# EAGLE design backplane (EAGLE 9.4.2)

## Sheet 1 of 3: Expansion Input and Buffers
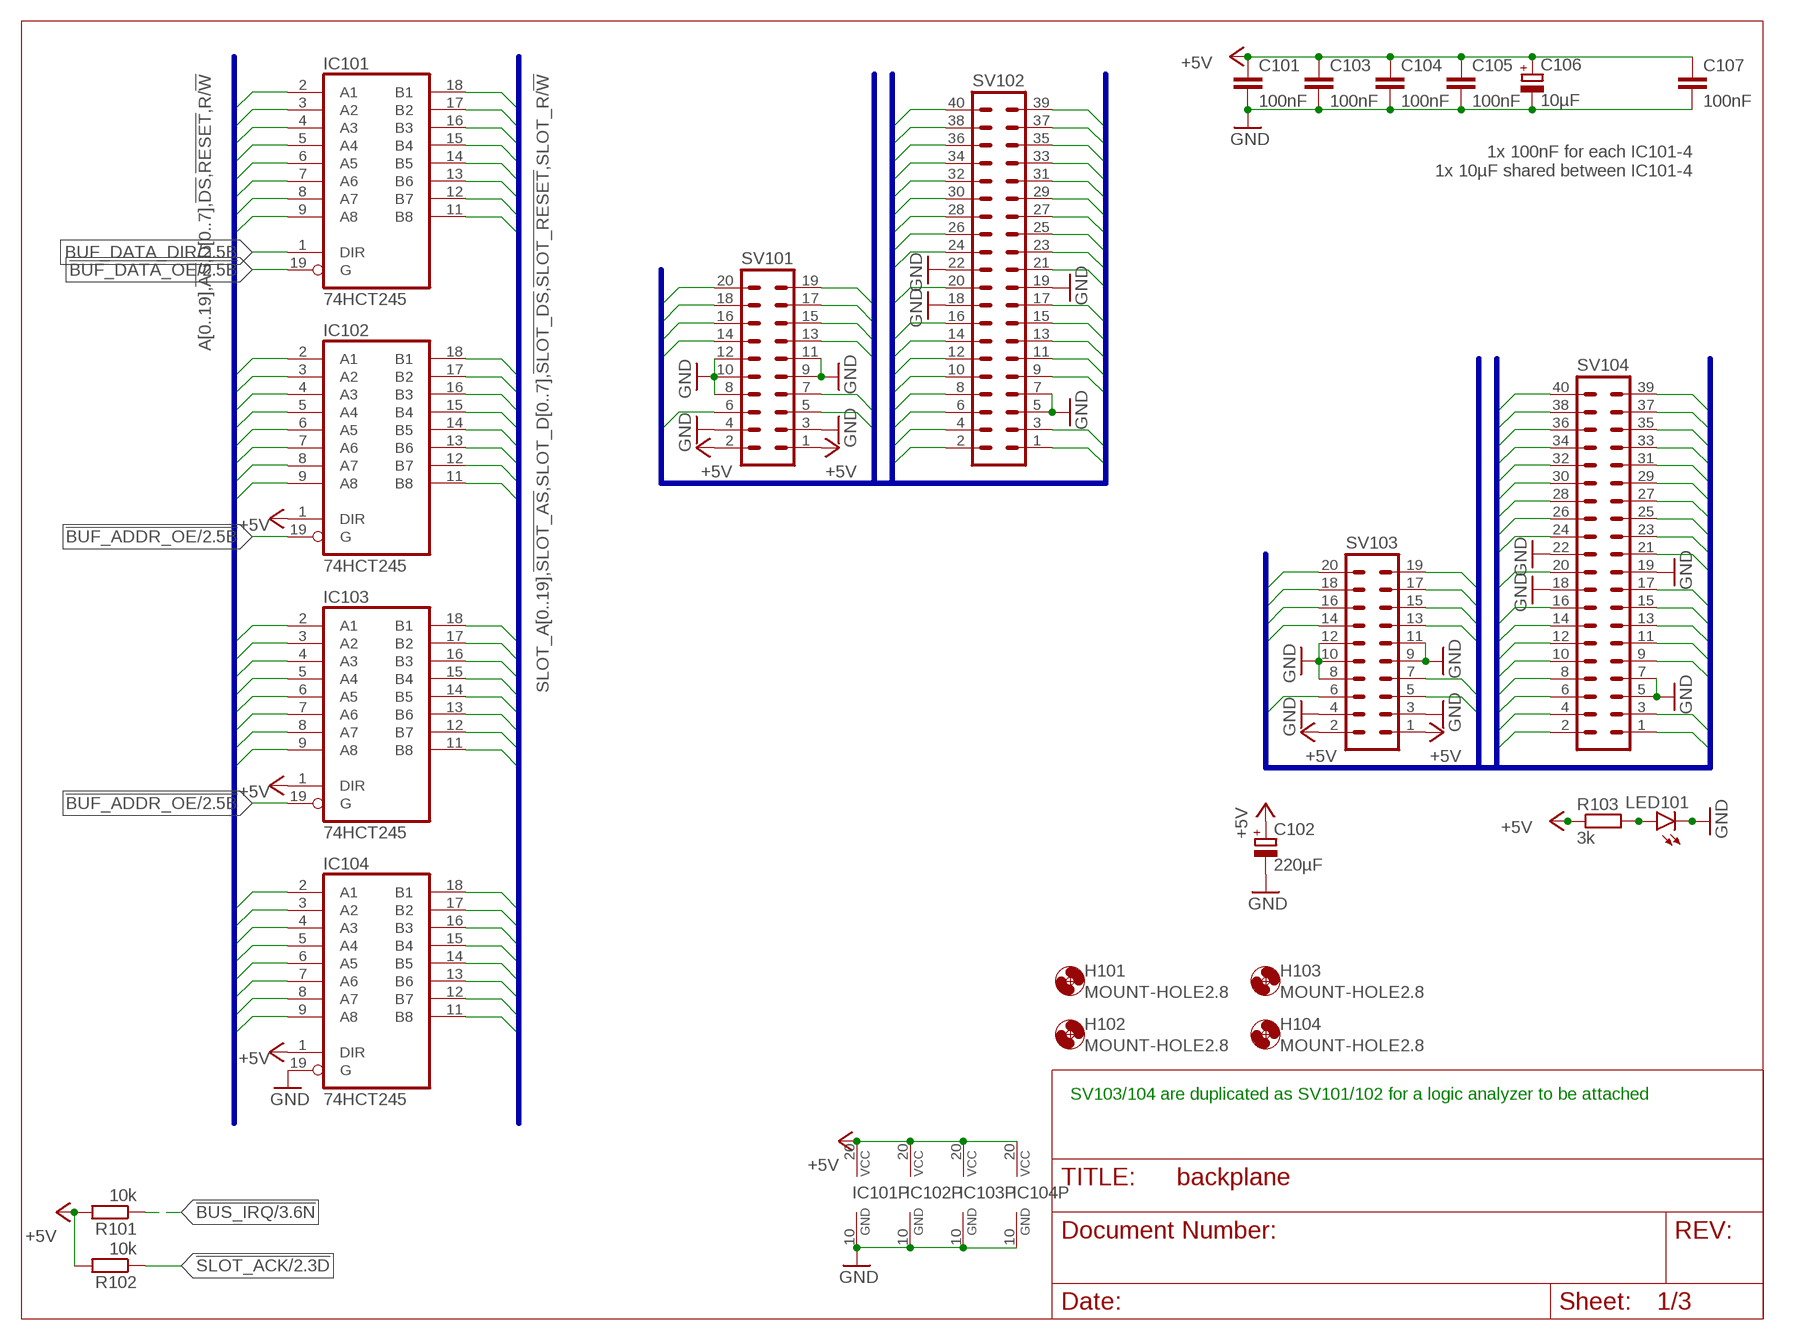
[diagram p0: schematic, sheet 1]

### Parts
C101  100nF  C-EUC0805  [C0805]
C102  220µF  CPOL-EUE3.5-8  [E3,5-8]
C103  100nF  C-EUC0805  [C0805]
C104  100nF  C-EUC0805  [C0805]
C105  100nF  C-EUC0805  [C0805]
C106  10µF  CPOL-EUSMCB  [SMC_B]
C107  100nF  C-EUC0805  [C0805]
H101  MOUNT-HOLE2.8  [2,8]
H102  MOUNT-HOLE2.8  [2,8]
H103  MOUNT-HOLE2.8  [2,8]
H104  MOUNT-HOLE2.8  [2,8]
IC101  74HCT245  74HCT245DW  [SO20W]
IC102  74HCT245  74HCT245DW  [SO20W]
IC103  74HCT245  74HCT245DW  [SO20W]
IC104  74HCT245  74HCT245DW  [SO20W]
LED101  LEDCHIPLED_1206  [CHIPLED_1206]
R101  10k  R-EU_R2012  [R2012]
R102  10k  R-EU_R2012  [R2012]
R103  3k  R-EU_R2012  [R2012]
SV101  MA10-2  [MA10-2]
SV102  MA20-2  [MA20-2]
SV103  MA10-2W  [MA10-2W]
SV104  MA20-2W  [MA20-2W]

### Nets
!AS: IC104.2(A1) SV102.33 SV104.33
!BERR: SV102.9 SV104.9
!BG: SV102.25 SV104.25
!BR: SV102.23 SV104.23
!BUF_ADDR_OE: IC102.19(G) IC103.19(G) ; also sheet 2
!BUF_DATA_OE: IC101.19(G) ; also sheet 2
!BUS_CS: SV101.7 SV103.7 ; also sheet 2
!BUS_DTACK: SV101.6 SV103.6 ; also sheet 2
!BUS_IRQ: R101.1 SV101.5 SV103.5 ; also sheet 3
!DS: IC104.3(A2) SV102.31 SV104.31
!DTACK: SV102.27 SV104.27
!HALT: SV102.17 SV104.17
!RESET: IC104.9(A8) SV102.15 SV104.15
!SLOT_ACK: R102.1 ; also sheet 2,3
!SLOT_AS: IC104.18(B1) ; also sheet 3
!SLOT_DS: IC104.17(B2) ; also sheet 2,3
!SLOT_RESET: IC104.11(B8) ; also sheet 2,3
!VPA: SV102.11 SV104.11
+5V: C101.1 C102.+ C103.1 C104.1 C105.1 C106.+ C107.1 IC101.20(VCC) IC102.1(DIR) IC102.20(VCC) IC103.1(DIR) IC103.20(VCC) IC104.1(DIR) IC104.20(VCC) R101.2 R102.2 R103.1 SV101.1 SV101.2 SV103.1 SV103.2 ; also sheet 2,3
A0: IC102.5(A4) SV101.17 SV103.17
A1: IC102.7(A6) SV101.15 SV103.15
A2: IC102.9(A8) SV101.13 SV103.13
A3: IC102.8(A7) SV101.14 SV103.14
A4: IC102.6(A5) SV101.16 SV103.16
A5: IC102.4(A3) SV101.18 SV103.18
A6: IC102.3(A2) SV101.20 SV103.20
A7: IC102.2(A1) SV102.2 SV104.2
A8: IC103.9(A8) SV102.4 SV104.4
A9: IC103.8(A7) SV102.6 SV104.6
A10: IC103.7(A6) SV102.8 SV104.8
A11: IC103.6(A5) SV102.10 SV104.10
A12: IC103.5(A4) SV102.12 SV104.12
A13: IC103.4(A3) SV102.14 SV104.14
A14: IC103.3(A2) SV102.16 SV104.16
A15: IC103.2(A1) SV102.20 SV104.20
A16: IC104.8(A7) SV102.24 SV104.24
A17: IC104.7(A6) SV102.26 SV104.26
A18: IC104.6(A5) SV102.28 SV104.28
A19: IC104.4(A3) SV102.30 SV104.30
BUF_DATA_DIR: IC101.1(DIR) ; also sheet 2
CLK: SV102.21 SV104.21 ; also sheet 2
D0: IC101.7(A6) SV102.35 SV104.35
D1: IC101.5(A4) SV102.37 SV104.37
D2: IC101.3(A2) SV102.39 SV104.39
D3: IC101.2(A1) SV102.40 SV104.40
D4: IC101.4(A3) SV102.38 SV104.38
D5: IC101.6(A5) SV102.36 SV104.36
D6: IC101.8(A7) SV102.34 SV104.34
D7: IC101.9(A8) SV102.32 SV104.32
E: SV102.13 SV104.13
FC0: SV101.19 SV103.19
FC1: SV102.1 SV104.1
FC2: SV102.3 SV104.3
GND: C101.2 C102.- C103.2 C104.2 C105.2 C106.- C107.2 IC101.10(GND) IC102.10(GND) IC103.10(GND) IC104.10(GND) IC104.19(G) LED101.C SV101.3 SV101.4 SV101.8 SV101.9 SV101.10 SV101.11 SV101.12 SV102.5 SV102.7 SV102.18 SV102.19 SV102.22 SV103.3 SV103.4 SV103.8 SV103.9 SV103.10 SV103.11 SV103.12 SV104.5 SV104.7 SV104.18 SV104.19 SV104.22 ; also sheet 2,3
N$4: LED101.A R103.2
R/!W!: IC104.5(A4) SV102.29 SV104.29
SLOT_A0: IC102.15(B4) ; also sheet 3
SLOT_A1: IC102.13(B6) ; also sheet 3
SLOT_A2: IC102.11(B8) ; also sheet 3
SLOT_A3: IC102.12(B7) ; also sheet 3
SLOT_A4: IC102.14(B5) ; also sheet 3
SLOT_A5: IC102.16(B3) ; also sheet 3
SLOT_A6: IC102.17(B2) ; also sheet 3
SLOT_A7: IC102.18(B1) ; also sheet 3
SLOT_A8: IC103.11(B8) ; also sheet 3
SLOT_A9: IC103.12(B7) ; also sheet 3
SLOT_A10: IC103.13(B6) ; also sheet 3
SLOT_A11: IC103.14(B5) ; also sheet 3
SLOT_A12: IC103.15(B4) ; also sheet 3
SLOT_A13: IC103.16(B3) ; also sheet 3
SLOT_A14: IC103.17(B2) ; also sheet 3
SLOT_A15: IC103.18(B1) ; also sheet 3
SLOT_A16: IC104.12(B7) ; also sheet 2
SLOT_A17: IC104.13(B6) ; also sheet 2
SLOT_A18: IC104.14(B5) ; also sheet 2
SLOT_A19: IC104.16(B3) ; also sheet 2
SLOT_D0: IC101.13(B6) ; also sheet 3
SLOT_D1: IC101.15(B4) ; also sheet 3
SLOT_D2: IC101.17(B2) ; also sheet 3
SLOT_D3: IC101.18(B1) ; also sheet 3
SLOT_D4: IC101.16(B3) ; also sheet 3
SLOT_D5: IC101.14(B5) ; also sheet 3
SLOT_D6: IC101.12(B7) ; also sheet 3
SLOT_D7: IC101.11(B8) ; also sheet 3
SLOT_R/!W!: IC104.15(B4) ; also sheet 2,3

### Buses
A[0..19],!AS,!BERR,!BG,!BR,!BUS_CS,!BUS_DTACK,!BUS_IRQ,CLK,D[0..7],!DS,!DTACK,E,FC[0..2],!HALT,!RESET,R/!W!,!VPA
A[0..19],!AS,D[0..7],!DS,!RESET,R/!W!
SLOT_A[0..19],!SLOT_AS,SLOT_D[0..7],!SLOT_DS,!SLOT_RESET,SLOT_R/!W!

### Notes on the sheet
- 1x 100nF for each IC101-4
  1x 10µF shared between IC101-4
- SV103/104 are duplicated as SV101/102 for a logic analyzer to be attached

## Sheet 2 of 3: Logic
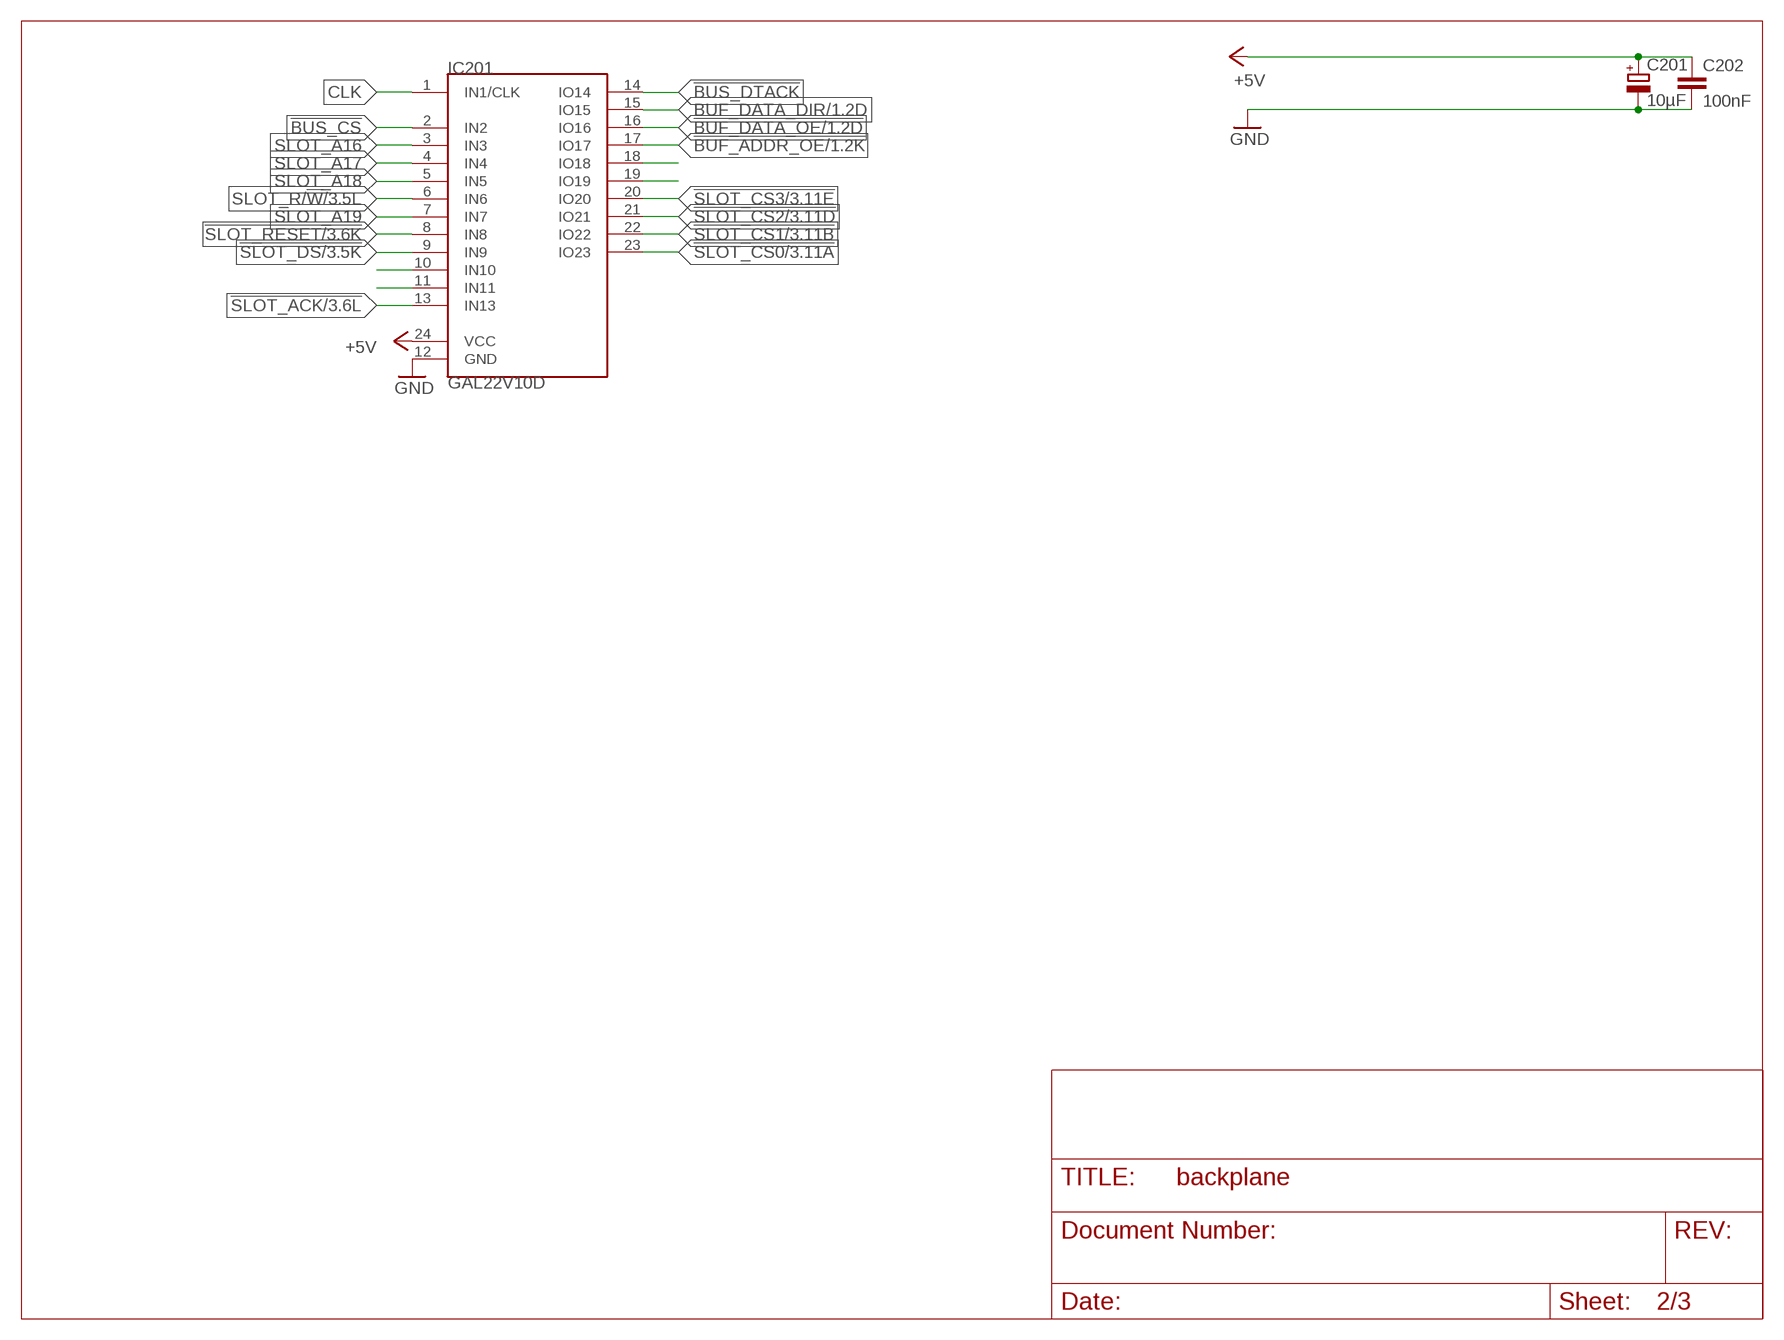
[diagram p1: schematic, sheet 2]

### Parts
C201  10µF  CPOL-EUSMCB  [SMC_B]
C202  100nF  C-EUC0805  [C0805]
IC201  GAL22V10D  GAL22V10DIP24  [DIL24S]

### Nets
!BUF_ADDR_OE: IC201.17(IO17) ; also sheet 1
!BUF_DATA_OE: IC201.16(IO16) ; also sheet 1
!BUS_CS: IC201.2(IN2) ; also sheet 1
!BUS_DTACK: IC201.14(IO14) ; also sheet 1
!SLOT_ACK: IC201.13(IN13) ; also sheet 1,3
!SLOT_CS0: IC201.23(IO23) ; also sheet 3
!SLOT_CS1: IC201.22(IO22) ; also sheet 3
!SLOT_CS2: IC201.21(IO21) ; also sheet 3
!SLOT_CS3: IC201.20(IO20) ; also sheet 3
!SLOT_DS: IC201.9(IN9) ; also sheet 1,3
!SLOT_RESET: IC201.8(IN8) ; also sheet 1,3
+5V: C201.+ C202.1 IC201.24(VCC) ; also sheet 1,3
BUF_DATA_DIR: IC201.15(IO15) ; also sheet 1
CLK: IC201.1(IN1/CLK) ; also sheet 1
GND: C201.- C202.2 IC201.12(GND) ; also sheet 1,3
N$14: IC201.10(IN10)
N$15: IC201.11(IN11)
N$20: IC201.19(IO19)
N$27: IC201.18(IO18)
SLOT_A16: IC201.3(IN3) ; also sheet 1
SLOT_A17: IC201.4(IN4) ; also sheet 1
SLOT_A18: IC201.5(IN5) ; also sheet 1
SLOT_A19: IC201.7(IN7) ; also sheet 1
SLOT_R/!W!: IC201.6(IN6) ; also sheet 1,3

## Sheet 3 of 3: Expansion Slots
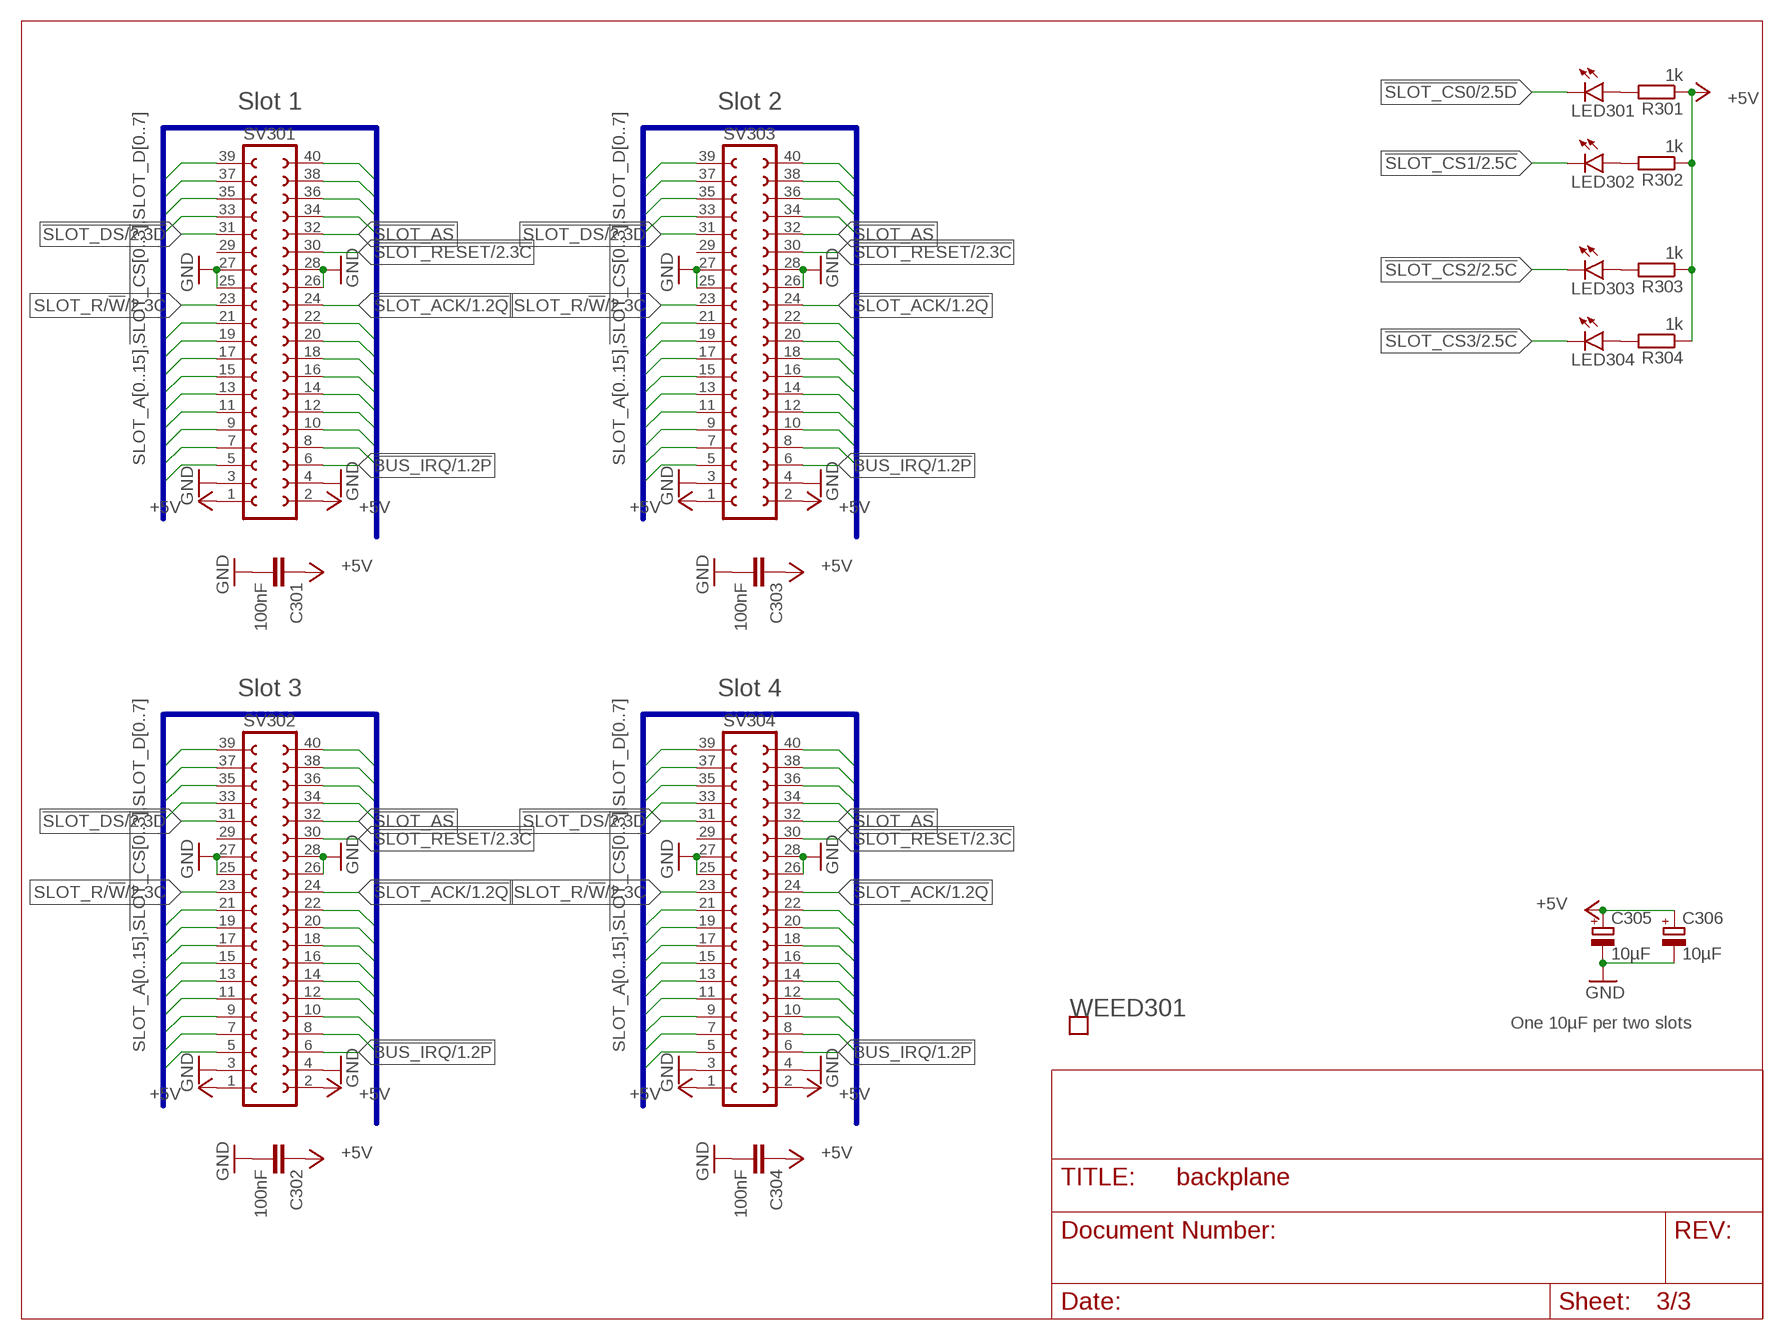
[diagram p2: schematic, sheet 3]

### Parts
C301  100nF  C-EUC0805  [C0805]
C302  100nF  C-EUC0805  [C0805]
C303  100nF  C-EUC0805  [C0805]
C304  100nF  C-EUC0805  [C0805]
C305  10µF  CPOL-EUSMCB  [SMC_B]
C306  10µF  CPOL-EUSMCB  [SMC_B]
LED301  LEDCHIPLED_1206  [CHIPLED_1206]
LED302  LEDCHIPLED_1206  [CHIPLED_1206]
LED303  LEDCHIPLED_1206  [CHIPLED_1206]
LED304  LEDCHIPLED_1206  [CHIPLED_1206]
R301  1k  R-EU_R2012  [R2012]
R302  1k  R-EU_R2012  [R2012]
R303  1k  R-EU_R2012  [R2012]
R304  1k  R-EU_R2012  [R2012]
SV301  FE20-2  [FE20-2]
SV302  FE20-2  [FE20-2]
SV303  FE20-2  [FE20-2]
SV304  FE20-2  [FE20-2]
WEED301  WEED  [DOINK]

### Nets
!BUS_IRQ: SV301.6 SV302.6 SV303.6 SV304.6 ; also sheet 1
!SLOT_ACK: SV301.24 SV302.24 SV303.24 SV304.24 ; also sheet 1,2
!SLOT_AS: SV301.32 SV302.32 SV303.32 SV304.32 ; also sheet 1
!SLOT_CS0: LED301.C SV301.5 ; also sheet 2
!SLOT_CS1: LED302.C SV303.5 ; also sheet 2
!SLOT_CS2: LED303.C SV302.5 ; also sheet 2
!SLOT_CS3: LED304.C SV304.5 ; also sheet 2
!SLOT_DS: SV301.31 SV302.31 SV303.31 SV304.31 ; also sheet 1,2
!SLOT_RESET: SV301.30 SV302.30 SV303.30 SV304.30 ; also sheet 1,2
+5V: C301.1 C302.1 C303.1 C304.1 C305.+ C306.+ R301.1 R302.1 R303.1 R304.1 SV301.1 SV301.2 SV302.1 SV302.2 SV303.1 SV303.2 SV304.1 SV304.2 ; also sheet 1,2
GND: C301.2 C302.2 C303.2 C304.2 C305.- C306.- SV301.3 SV301.4 SV301.25 SV301.26 SV301.27 SV301.28 SV302.3 SV302.4 SV302.25 SV302.26 SV302.27 SV302.28 SV303.3 SV303.4 SV303.25 SV303.26 SV303.27 SV303.28 SV304.3 SV304.4 SV304.25 SV304.26 SV304.27 SV304.28 ; also sheet 1,2
N$1: LED302.A R302.2
N$2: LED301.A R301.2
N$3: LED304.A R304.2
N$5: LED303.A R303.2
SLOT_A0: SV301.12 SV302.12 SV303.12 SV304.12 ; also sheet 1
SLOT_A1: SV301.10 SV302.10 SV303.10 SV304.10 ; also sheet 1
SLOT_A2: SV301.8 SV302.8 SV303.8 SV304.8 ; also sheet 1
SLOT_A3: SV301.7 SV302.7 SV303.7 SV304.7 ; also sheet 1
SLOT_A4: SV301.9 SV302.9 SV303.9 SV304.9 ; also sheet 1
SLOT_A5: SV301.11 SV302.11 SV303.11 SV304.11 ; also sheet 1
SLOT_A6: SV301.14 SV302.14 SV303.14 SV304.14 ; also sheet 1
SLOT_A7: SV301.13 SV302.13 SV303.13 SV304.13 ; also sheet 1
SLOT_A8: SV301.16 SV302.16 SV303.16 SV304.16 ; also sheet 1
SLOT_A9: SV301.15 SV302.15 SV303.15 SV304.15 ; also sheet 1
SLOT_A10: SV301.18 SV302.18 SV303.18 SV304.18 ; also sheet 1
SLOT_A11: SV301.17 SV302.17 SV303.17 SV304.17 ; also sheet 1
SLOT_A12: SV301.20 SV302.20 SV303.20 SV304.20 ; also sheet 1
SLOT_A13: SV301.19 SV302.19 SV303.19 SV304.19 ; also sheet 1
SLOT_A14: SV301.22 SV302.22 SV303.22 SV304.22 ; also sheet 1
SLOT_A15: SV301.21 SV302.21 SV303.21 SV304.21 ; also sheet 1
SLOT_D0: SV301.35 SV302.35 SV303.35 SV304.35 ; also sheet 1
SLOT_D1: SV301.37 SV302.37 SV303.37 SV304.37 ; also sheet 1
SLOT_D2: SV301.39 SV302.39 SV303.39 SV304.39 ; also sheet 1
SLOT_D3: SV301.40 SV302.40 SV303.40 SV304.40 ; also sheet 1
SLOT_D4: SV301.38 SV302.38 SV303.38 SV304.38 ; also sheet 1
SLOT_D5: SV301.36 SV302.36 SV303.36 SV304.36 ; also sheet 1
SLOT_D6: SV301.34 SV302.34 SV303.34 SV304.34 ; also sheet 1
SLOT_D7: SV301.33 SV302.33 SV303.33 SV304.33 ; also sheet 1
SLOT_R/!W!: SV301.23 SV302.23 SV303.23 SV304.23 ; also sheet 1,2
Unconnected: SV301.29 SV302.29 SV303.29 SV304.29

### Buses
SLOT_A[0..15],!SLOT_CS[0..3],SLOT_D[0..7]

### Notes on the sheet
- Slot 1 | Slot 2
- Slot 3 | Slot 4
- One 10µF per two slots

## Library data of the parts
C101 C103-C105 C107 C202 C301-C304 = rcl:C-EU: CAPACITOR, European symbol; MOUSER: 710-885012207072; SPICEPREFIX: C
C102 = rcl:CPOL-EU: POLARIZED CAPACITOR, European symbol; MOUSER: 710-860020474012; SPICEPREFIX: C
C106 C201 C305 C306 = rcl:CPOL-EU: POLARIZED CAPACITOR, European symbol; MOUSER: 581-TAJB106K020RNJV; SPICEPREFIX: C
H101-H104 = holes:MOUNT-HOLE: MOUNTING HOLE with drill center marker
IC101-IC104 = 74xx-eu:74*245: Octal BUS TRANSCEIVER, 3-state; MOUSER: 595-SN74HCT245DBR
IC201 = 68komputer:GAL22V10: GAL22V10D – Generic Array Logic Datasheet <http://web.mit.edu/6.115/www/document/gal22v10.pdf>; MOUSER_SOCKET: 575-11044324
LED101 = led:LED: LED OSRAM: - CHIPLED LG R971, LG N971, LY N971, LG Q971, LY Q971, LO R971, LY R971 LH N974, LH R974 LS Q976, LO Q976, LY Q976 LO Q996 - Hyper CHIPLED LW Q18S LB Q993, LB Q99A, LB R99A - SideLED LS A670, LO A670, LY A670, LG A670, LP A670 LB A673, LV A673, LT A673, LW A673 LH A674 LY A675 LS A676, LA A676, LO A676, LY A676, LW A676 LS A679, LY A679, LG A679 - Hyper Micro SIDELED® LS Y876, LA Y876, LO Y876, LY Y876 LT Y87S - SmartLED LW L88C, LW L88S LB L89C, LB L89S, LG L890 LS L89K, LO L89K, LY L89K LS L896, LA L896, LO L896, LY L896 - TOPLED LS T670, LO T670, LY T670, LG T670, LP T670 LSG T670, LSP T670, LSY T670, LOP T670, LYG T670 LG T671, LOG T671, LSG T671 LB T673, LV T673, LT T673, LW T673 LH T674 LS T676, LA T676, LO T676, LY T676, LB T676, LH T676, LSB T676, LW T676 LB T67C, LV T67C, LT T67C, LS T67K, LO T67K, LY T67K, LW E67C LS E67B, LA E67B, LO E67B, LY E67B, LB E67C, LV E67C, LT E67C LW T67C LS T679, LY T679, LG T679 LS T770, LO T770, LY T770, LG T770, LP T770 LB T773, LV T773, LT T773, LW T773 LH T774 LS E675, LA E675, LY E675, LS T675 LS T776, LA T776, LO T776, LY T776, LB T776 LHGB T686 LT T68C, LB T68C - Hyper Mini TOPLED® LB M676 - Mini TOPLED Santana® LG M470 LS M47K, LO M47K, LY M47K Source: http://www.osram.convergy.de LUXEON: - LUMILED® LXK2-PW12-R00, LXK2-PW12-S00, LXK2-PW14-U00, LXK2-PW14-V00 LXK2-PM12-R00, LXK2-PM12-S00, LXK2-PM14-U00 LXK2-PE12-Q00, LXK2-PE12-R00, LXK2-PE12-S00, LXK2-PE14-T00, LXK2-PE14-U00 LXK2-PB12-K00, LXK2-PB12-L00, LXK2-PB12-M00, LXK2-PB14-N00, LXK2-PB14-P00, LXK2-PB14-Q00 LXK2-PR12-L00, LXK2-PR12-M00, LXK2-PR14-Q00, LXK2-PR14-R00 LXK2-PD12-Q00, LXK2-PD12-R00, LXK2-PD12-S00 LXK2-PH12-R00, LXK2-PH12-S00 LXK2-PL12-P00, LXK2-PL12-Q00, LXK2-PL12-R00 Source: www.luxeon.com KINGBRIGHT: KA-3528ASYC Source: www.kingbright.com; MOUSER: 710-156120YS75300
LED301-LED304 = led:LED: LED OSRAM: - CHIPLED LG R971, LG N971, LY N971, LG Q971, LY Q971, LO R971, LY R971 LH N974, LH R974 LS Q976, LO Q976, LY Q976 LO Q996 - Hyper CHIPLED LW Q18S LB Q993, LB Q99A, LB R99A - SideLED LS A670, LO A670, LY A670, LG A670, LP A670 LB A673, LV A673, LT A673, LW A673 LH A674 LY A675 LS A676, LA A676, LO A676, LY A676, LW A676 LS A679, LY A679, LG A679 - Hyper Micro SIDELED® LS Y876, LA Y876, LO Y876, LY Y876 LT Y87S - SmartLED LW L88C, LW L88S LB L89C, LB L89S, LG L890 LS L89K, LO L89K, LY L89K LS L896, LA L896, LO L896, LY L896 - TOPLED LS T670, LO T670, LY T670, LG T670, LP T670 LSG T670, LSP T670, LSY T670, LOP T670, LYG T670 LG T671, LOG T671, LSG T671 LB T673, LV T673, LT T673, LW T673 LH T674 LS T676, LA T676, LO T676, LY T676, LB T676, LH T676, LSB T676, LW T676 LB T67C, LV T67C, LT T67C, LS T67K, LO T67K, LY T67K, LW E67C LS E67B, LA E67B, LO E67B, LY E67B, LB E67C, LV E67C, LT E67C LW T67C LS T679, LY T679, LG T679 LS T770, LO T770, LY T770, LG T770, LP T770 LB T773, LV T773, LT T773, LW T773 LH T774 LS E675, LA E675, LY E675, LS T675 LS T776, LA T776, LO T776, LY T776, LB T776 LHGB T686 LT T68C, LB T68C - Hyper Mini TOPLED® LB M676 - Mini TOPLED Santana® LG M470 LS M47K, LO M47K, LY M47K Source: http://www.osram.convergy.de LUXEON: - LUMILED® LXK2-PW12-R00, LXK2-PW12-S00, LXK2-PW14-U00, LXK2-PW14-V00 LXK2-PM12-R00, LXK2-PM12-S00, LXK2-PM14-U00 LXK2-PE12-Q00, LXK2-PE12-R00, LXK2-PE12-S00, LXK2-PE14-T00, LXK2-PE14-U00 LXK2-PB12-K00, LXK2-PB12-L00, LXK2-PB12-M00, LXK2-PB14-N00, LXK2-PB14-P00, LXK2-PB14-Q00 LXK2-PR12-L00, LXK2-PR12-M00, LXK2-PR14-Q00, LXK2-PR14-R00 LXK2-PD12-Q00, LXK2-PD12-R00, LXK2-PD12-S00 LXK2-PH12-R00, LXK2-PH12-S00 LXK2-PL12-P00, LXK2-PL12-Q00, LXK2-PL12-R00 Source: www.luxeon.com KINGBRIGHT: KA-3528ASYC Source: www.kingbright.com; MOUSER: 710-156120VS75300
R101 R102 = rcl:R-EU_: RESISTOR, European symbol; MOUSER: 652-CR0805FX-1002ELF; SPICEPREFIX: R
R103 = rcl:R-EU_: RESISTOR, European symbol; MOUSER: 652-CR0805JW-302ELF; SPICEPREFIX: R
R301-R304 = rcl:R-EU_: RESISTOR, European symbol; MOUSER: 652-CR0805FX-1001ELF; SPICEPREFIX: R
SV101 = con-lstb:MA10-2: PIN HEADER; OC_FARNELL: unknown; OC_NEWARK: unknown
SV102 = con-lstb:MA20-2: PIN HEADER; OC_FARNELL: unknown; OC_NEWARK: unknown
SV103 = con-lstb:MA10-2W: PIN HEADER; OC_FARNELL: unknown; OC_NEWARK: unknown
SV104 = con-lstb:MA20-2W: PIN HEADER; OC_FARNELL: unknown; OC_NEWARK: unknown
SV301-SV304 = con-lsta:FE20-2: FEMALE HEADER; MOUSER: 710-61304021821; OC_FARNELL: unknown; OC_NEWARK: unknown
WEED301 = 68komputer:WEED

## Net classes
0 default: width 0.203 mm

## Board
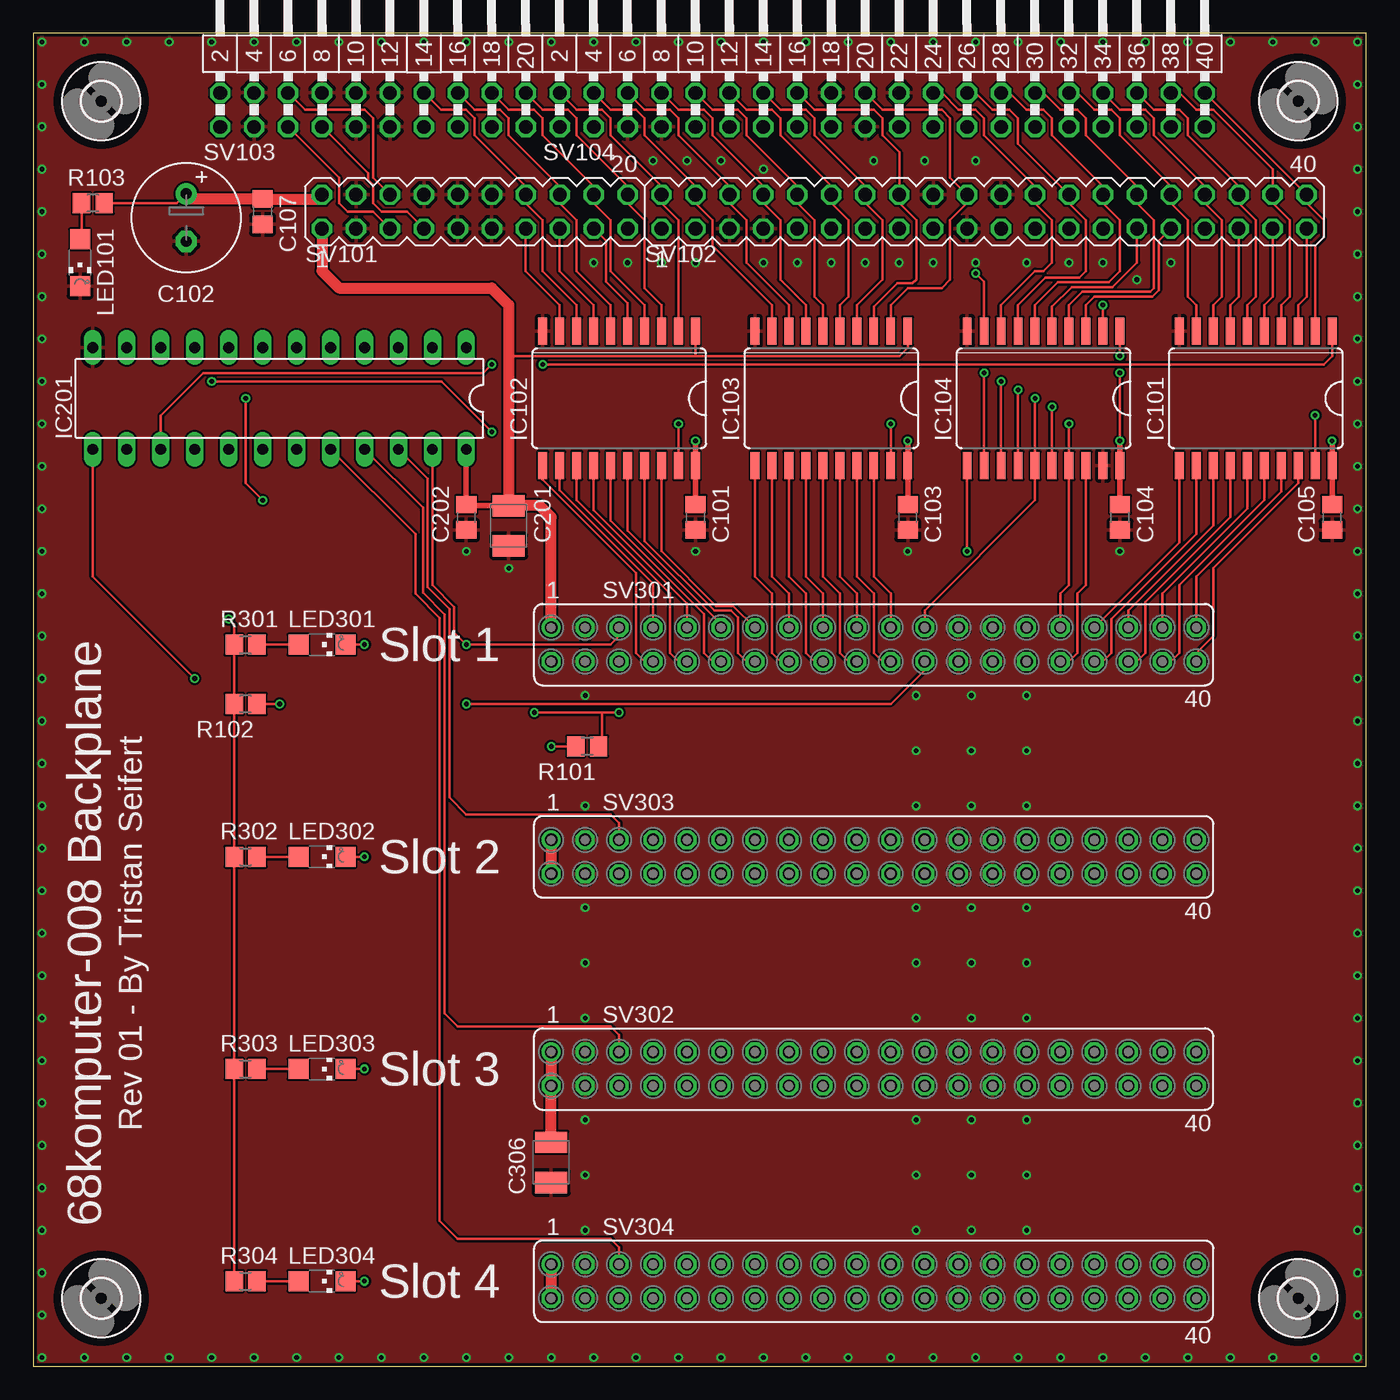
[diagram p3: board, top side]
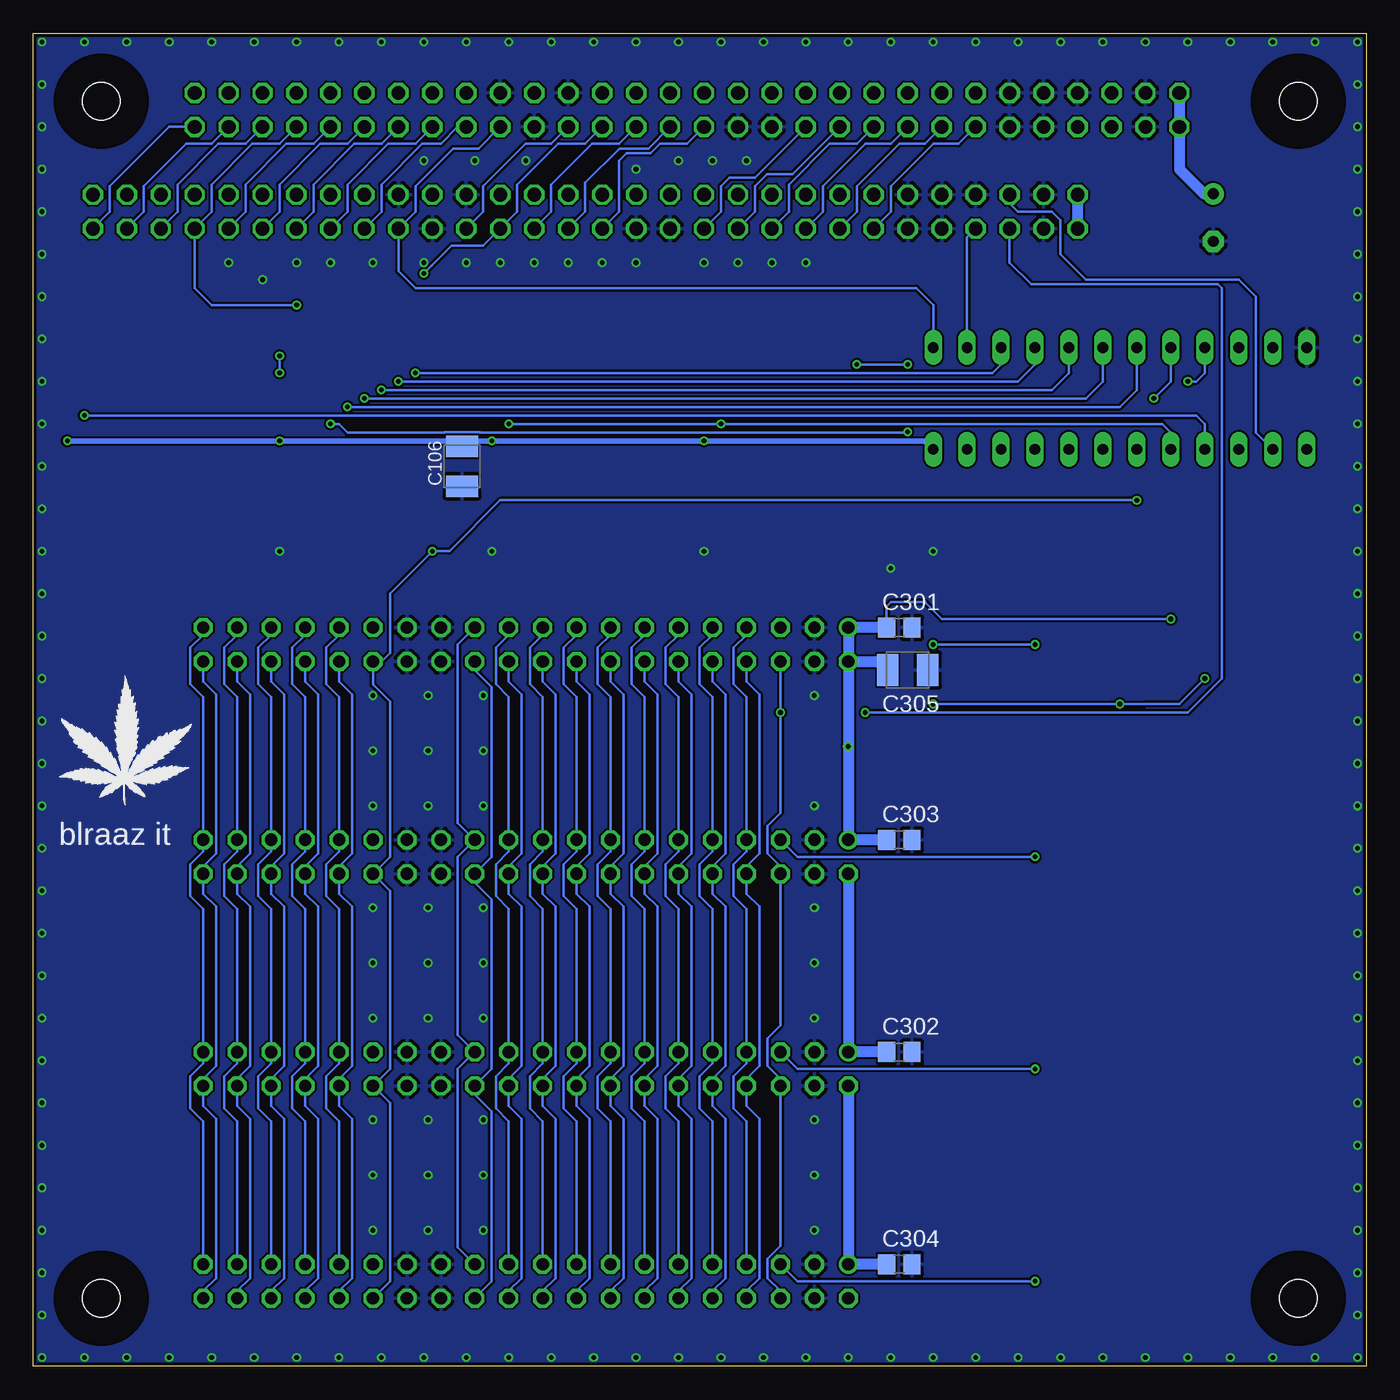
[diagram p4: board, bottom side, seen from below]

Size 99.69 x 99.69 mm. Coordinates in mm from the lower left corner, seen from the top.
Outline: 0,0 99.69,0 99.69,99.69 0,99.69 0,0
Copper layers (1*16): Top 0.035mm / dielectric 1.5mm / Bottom 0.035mm
Design rules "dirt_cheap_dirty_boards.v1.1": minimum track width 6mil, minimum drill 12mil, track to track 6mil, track to pad 6mil, pad to pad 6mil, via to via 6mil, smd to smd 0mil, copper to edge 10mil, drill to drill 10mil, minimum pad ring 10mil, minimum via ring 6mil, stop-mask expansion 2mil, vias tented up to drill 25mil, thermal gap 10mil

### Footprints (pad centres in the part's own frame; a part is rotated, then mirrored left to right if it is on the bottom)
C0805 = smd 1.3 x 1.5: 1 -0.95,0; 2 0.95,0
E3,5-8 = drill 0.813 pad 1.6: + -1.778,0 | drill 0.813 pad 1.6 octagon: - 1.778,0
SMC_B = smd 1.6 x 2.4: + -1.5,0; - 1.5,0
2,8 = hole 2.8: 0,0
SO20W = smd 0.66 x 2.032: 1 -5.715,-5.029; 2 -4.445,-5.029; 3 -3.175,-5.029; 4 -1.905,-5.029; 5 -0.635,-5.029; 6 0.635,-5.029; 7 1.905,-5.029; 8 3.175,-5.029; 9 4.445,-5.029; 10 5.715,-5.029; 11 5.715,5.029; 12 4.445,5.029; 13 3.175,5.029; 14 1.905,5.029; 15 0.635,5.029; 16 -0.635,5.029; 17 -1.905,5.029; 18 -3.175,5.029; 19 -4.445,5.029; 20 -5.715,5.029
DIL24S = drill 0.813 long: 1 -13.97,-3.81; 2 -11.43,-3.81; 3 -8.89,-3.81; 4 -6.35,-3.81; 5 -3.81,-3.81; 6 -1.27,-3.81; 7 1.27,-3.81; 8 3.81,-3.81; 9 6.35,-3.81; 10 8.89,-3.81; 11 11.43,-3.81; 12 13.97,-3.81; 13 13.97,3.81; 14 11.43,3.81; 15 8.89,3.81; 16 6.35,3.81; 17 3.81,3.81; 18 1.27,3.81; 19 -1.27,3.81; 20 -3.81,3.81; 21 -6.35,3.81; 22 -8.89,3.81; 23 -11.43,3.81; 24 -13.97,3.81
CHIPLED_1206 = smd 1.5 x 1.5: A 0,-1.75; C 0,1.75
R2012 = smd 1.3 x 1.5: 1 -0.85,0; 2 0.85,0
MA10-2 = drill 1.016 octagon: 1 -11.43,-1.27; 2 -11.43,1.27; 3 -8.89,-1.27; 4 -8.89,1.27; 5 -6.35,-1.27; 6 -6.35,1.27; 7 -3.81,-1.27; 8 -3.81,1.27; 9 -1.27,-1.27; 10 -1.27,1.27; 11 1.27,-1.27; 12 1.27,1.27; 13 3.81,-1.27; 14 3.81,1.27; 15 6.35,-1.27; 16 6.35,1.27; 17 8.89,-1.27; 18 8.89,1.27; 19 11.43,-1.27; 20 11.43,1.27
MA20-2 = drill 1.016 octagon: 1 -24.13,-1.27; 2 -24.13,1.27; 3 -21.59,-1.27; 4 -21.59,1.27; 5 -19.05,-1.27; 6 -19.05,1.27; 7 -16.51,-1.27; 8 -16.51,1.27; 9 -13.97,-1.27; 10 -13.97,1.27; 11 -11.43,-1.27; 12 -11.43,1.27; 13 -8.89,-1.27; 14 -8.89,1.27; 15 -6.35,-1.27; 16 -6.35,1.27; 17 -3.81,-1.27; 18 -3.81,1.27; 19 -1.27,-1.27; 20 -1.27,1.27; 21 1.27,-1.27; 22 1.27,1.27; 23 3.81,-1.27; 24 3.81,1.27; 25 6.35,-1.27; 26 6.35,1.27; 27 8.89,-1.27; 28 8.89,1.27; 29 11.43,-1.27; 30 11.43,1.27; 31 13.97,-1.27; 32 13.97,1.27; 33 16.51,-1.27; 34 16.51,1.27; 35 19.05,-1.27; 36 19.05,1.27; 37 21.59,-1.27; 38 21.59,1.27; 39 24.13,-1.27; 40 24.13,1.27
MA10-2W = drill 1.016 octagon: 1 -11.43,-1.27; 2 -11.43,1.27; 3 -8.89,-1.27; 4 -8.89,1.27; 5 -6.35,-1.27; 6 -6.35,1.27; 7 -3.81,-1.27; 8 -3.81,1.27; 9 -1.27,-1.27; 10 -1.27,1.27; 11 1.27,-1.27; 12 1.27,1.27; 13 3.81,-1.27; 14 3.81,1.27; 15 6.35,-1.27; 16 6.35,1.27; 17 8.89,-1.27; 18 8.89,1.27; 19 11.43,-1.27; 20 11.43,1.27
MA20-2W = drill 1.016 octagon: 1 -24.13,-1.27; 2 -24.13,1.27; 3 -21.59,-1.27; 4 -21.59,1.27; 5 -19.05,-1.27; 6 -19.05,1.27; 7 -16.51,-1.27; 8 -16.51,1.27; 9 -13.97,-1.27; 10 -13.97,1.27; 11 -11.43,-1.27; 12 -11.43,1.27; 13 -8.89,-1.27; 14 -8.89,1.27; 15 -6.35,-1.27; 16 -6.35,1.27; 17 -3.81,-1.27; 18 -3.81,1.27; 19 -1.27,-1.27; 20 -1.27,1.27; 21 1.27,-1.27; 22 1.27,1.27; 23 3.81,-1.27; 24 3.81,1.27; 25 6.35,-1.27; 26 6.35,1.27; 27 8.89,-1.27; 28 8.89,1.27; 29 11.43,-1.27; 30 11.43,1.27; 31 13.97,-1.27; 32 13.97,1.27; 33 16.51,-1.27; 34 16.51,1.27; 35 19.05,-1.27; 36 19.05,1.27; 37 21.59,-1.27; 38 21.59,1.27; 39 24.13,-1.27; 40 24.13,1.27
FE20-2 = drill 0.914: 1 -24.13,1.27 | drill 0.914 octagon: 2 -24.13,-1.27; 3 -21.59,1.27; 4 -21.59,-1.27; 5 -19.05,1.27; 6 -19.05,-1.27; 7 -16.51,1.27; 8 -16.51,-1.27; 9 -13.97,1.27; 10 -13.97,-1.27; 11 -11.43,1.27; 12 -11.43,-1.27; 13 -8.89,1.27; 14 -8.89,-1.27; 15 -6.35,1.27; 16 -6.35,-1.27; 17 -3.81,1.27; 18 -3.81,-1.27; 19 -1.27,1.27; 20 -1.27,-1.27; 21 1.27,1.27; 22 1.27,-1.27; 23 3.81,1.27; 24 3.81,-1.27; 25 6.35,1.27; 26 6.35,-1.27; 27 8.89,1.27; 28 8.89,-1.27; 29 11.43,1.27; 30 11.43,-1.27; 31 13.97,1.27; 32 13.97,-1.27; 33 16.51,1.27; 34 16.51,-1.27; 35 19.05,1.27; 36 19.05,-1.27; 37 21.59,1.27; 38 21.59,-1.27; 39 24.13,1.27; 40 24.13,-1.27

### Placement (x,y rotation side)
C101  49.53,63.5 270 top
C102  11.43,85.92 270 top
C103  65.41,63.5 270 top
C104  81.28,63.5 270 top
C105  97.16,63.5 270 top
C106  67.63,67.31 270 bottom
C107  17.14,86.36 270 top
C201  35.56,62.87 270 top
C202  32.38,63.5 270 top
C301  34.92,55.24 0 bottom
C302  34.92,23.5 0 bottom
C303  34.92,39.37 0 bottom
C304  34.92,7.62 0 bottom
C305  34.29,52.07 0 bottom
C306  38.73,15.24 270 top
H101  5.08,94.61 0 top
H102  5.08,5.08 0 top
H103  94.61,94.61 0 top
H104  94.61,5.08 0 top
IC101  91.44,72.39 180 top
IC102  43.81,72.39 180 top
IC103  59.69,72.39 180 top
IC104  75.56,72.39 180 top
IC201  18.41,72.39 180 top
LED101  3.49,82.55 180 top
LED301  21.59,53.98 270 top
LED302  21.59,38.1 270 top
LED303  21.59,22.23 270 top
LED304  21.59,6.35 270 top
R101  41.43,46.35 180 top
R102  15.88,49.53 180 top
R103  4.45,87 180 top
R301  15.88,53.98 0 top
R302  15.88,38.1 0 top
R303  15.88,22.23 0 top
R304  15.88,6.35 0 top
SV101  33.02,86.36 0 top
SV102  71.12,86.36 0 top
SV103  25.4,93.98 0 top
SV104  63.5,93.98 0 top
SV301  62.87,53.98 0 top
SV302  62.87,22.23 0 top
SV303  62.87,38.1 0 top
SV304  62.87,6.35 0 top
WEED301  97.79,41.91 0 bottom

### Tracks (layer width: path | path; a pad name or v marks a point on that pad's centre or on a via)
!AS  (via drill 0.35)
  Top 0.203: v80.01,79.38 IC104.2
  Bottom 0.203: v80.01,79.38 86.36,79.38 87.63,80.64 SV102.33 86.36,86.36 86.36,88.4 83.32,91.44 81.28,91.44 SV104.33
!BERR
  Bottom 0.203: SV104.9 50.8,91.44 52.84,91.44 53.55,90.73 55.32,90.73 55.88,90.17 55.88,86.36 SV102.9
!BG
  Bottom 0.203: SV104.25 71.12,91.44 73.16,91.44 76.2,88.4 76.2,86.36 SV102.25
!BR
  Bottom 0.203: SV104.23 67.94,92.71 69.22,91.44 70.62,91.44 73.66,88.4 73.66,86.36 SV102.23
!BUF_ADDR_OE  (via drill 0.35)
  Top 0.203: v48.26,70.48 IC102.19 | v64.14,70.48 IC103.19
  Bottom 0.203: IC201.17 14.61,69.85 15.24,70.48 v48.26,70.48 v64.14,70.48
!BUF_DATA_OE  (via drill 0.35)
  Top 0.203: v95.89,71.12 IC101.19
  Bottom 0.203: IC201.16 12.06,70.48 12.7,71.12 v95.89,71.12
!BUS_CS
  Top 0.203: SV103.7 25.04,89.26 25.04,88.75 25.4,88.4 25.4,87 26.04,86.36 27.94,86.36 SV101.7
  Bottom 0.203: SV101.7 29.84,84.45 IC201.2
!BUS_DTACK
  Top 0.203: SV103.6 20.32,93.98 24.77,93.98 25.4,93.34 25.4,88.9 SV101.6
  Bottom 0.203: SV101.6 26.67,87 26.04,86.36 23.5,86.36 22.86,85.72 22.86,83.19 20.95,81.28 9.53,81.28 8.26,80.01 8.26,69.85 IC201.14
!BUS_IRQ  (via drill 0.35)
  Top 0.203: SV103.5 22.86,88.9 22.86,87 23.5,86.36 25.4,86.36 SV101.5 | v37.47,48.9 42.55,48.9 | 42.55,48.9 v43.81,48.9 | 42.55,48.9 42.55,46.62 R101.1
  Bottom 0.203: SV301.6 v43.81,48.9 43.81,41.37 44.78,40.41 44.78,38.34 43.81,37.37 SV303.6 43.81,25.5 44.78,24.53 44.78,22.46 43.81,21.5 SV302.6 43.81,8.98 44.78,8.02 44.78,6.58 43.81,5.62 SV304.6 | SV101.5 26.67,82.55 25.04,80.92 11.07,80.92 10.79,80.64 10.79,51.44 13.34,48.9 v37.47,48.9
!DS
  Top 0.203: IC104.3 78.74,79.38 79.38,80.01 83.69,80.01 84.18,80.5 84.18,84.18 SV102.31
  Bottom 0.203: SV104.31 78.74,91.44 80.78,91.44 83.82,88.4 83.82,86.36 SV102.31
!DTACK
  Bottom 0.203: SV104.27 73.66,91.44 75.7,91.44 78.74,88.4 78.74,86.36 SV102.27
!HALT
  Bottom 0.203: SV104.17 60.96,91.44 62.87,91.44 66.04,88.27 66.04,86.36 SV102.17
!RESET  (via drill 0.35)
  Top 0.203: v70.48,81.74 71.12,81.11 IC104.9
  Bottom 0.203: SV104.15 58.42,91.44 60.46,91.44 63.5,88.4 63.5,86.36 SV102.15 66.04,83.82 68.41,83.82 69.9,82.32 69.9,82.31 70.24,81.97 70.26,81.97 v70.48,81.74
!SLOT_ACK  (via drill 0.35)
  Top 0.203: SV301.24 66.67,52.07 64.14,49.53 v32.38,49.53 | v12.06,51.44 4.45,59.05 IC201.13 | R102.1 v18.41,49.53
  Bottom 0.203: SV304.24 65.41,6.35 65.41,19.05 66.67,20.32 SV302.24 65.41,22.23 65.41,34.92 66.67,36.2 SV303.24 65.41,38.1 65.41,50.8 66.67,52.07 SV301.24 | v32.38,49.53 19.05,49.53 v18.41,49.53 16.51,49.53 13.97,49.53 v12.06,51.44
!SLOT_AS
  Top 0.203: IC104.18 78.74,58.42 78.11,57.78 78.11,53.34 77.47,52.7 SV301.32
  Bottom 0.203: SV301.32 76.83,51.21 75.87,50.24 75.87,38.34 76.83,37.37 SV303.32 76.83,35.33 75.87,34.37 75.87,22.46 76.83,21.5 SV302.32 76.83,19.46 75.87,18.49 75.87,6.58 76.83,5.62 SV304.32
!SLOT_CS0  (via drill 0.35)
  Top 0.203: IC201.23 29.84,58.42 31.47,56.79 31.47,54.89 v32.38,53.98 43.18,53.98 43.81,54.61 SV301.5 | LED301.C v24.77,53.98
  Bottom 0.203: v24.77,53.98 v32.38,53.98
!SLOT_CS1  (via drill 0.35)
  Top 0.203: IC201.22 29.49,66.4 29.49,58.27 31.11,56.65 31.11,42.55 32.38,41.27 43.18,41.27 43.81,40.64 SV303.5 | LED302.C v24.77,38.1
  Bottom 0.203: v24.77,38.1 42.55,38.1 SV303.5
!SLOT_CS2  (via drill 0.35)
  Top 0.203: IC201.21 29.13,64.21 29.13,57.86 30.76,56.24 30.76,26.39 31.75,25.4 43.18,25.4 43.81,24.77 SV302.5 | LED303.C v24.77,22.23
  Bottom 0.203: v24.77,22.23 42.55,22.23 SV302.5
!SLOT_CS3  (via drill 0.35)
  Top 0.203: IC201.20 28.57,62.23 28.57,57.78 30.4,55.96 30.4,10.87 31.75,9.53 43.18,9.53 43.81,8.89 SV304.5 | LED304.C v24.77,6.35
  Bottom 0.203: v24.77,6.35 42.55,6.35 SV304.5
!SLOT_DS  (via drill 0.35)
  Top 0.203: SV301.31 76.83,57.78 77.47,58.42 IC104.17 v77.47,70.48 | v34.29,69.9 30.53,73.66 v13.34,73.66
  Bottom 0.203: SV301.31 76.83,54.7 77.8,53.74 77.8,51.03 76.83,50.07 SV303.31 76.83,38.51 77.8,37.54 77.8,35.16 76.83,34.2 SV302.31 76.83,22.63 77.8,21.67 77.8,19.29 76.83,18.32 SV304.31 | v77.47,70.48 76.83,70.48 76.2,69.85 68.95,69.85 68.93,69.86 66.32,69.86 66.31,69.85 34.34,69.85 v34.29,69.9 | v13.34,73.66 12.7,73.66 12.06,74.3 IC201.9
!SLOT_RESET  (via drill 0.35)
  Top 0.203: IC104.11 v69.85,60.96 | v17.14,64.77 15.88,66.04 v15.88,72.39
  Bottom 0.203: SV304.30 73.03,6.35 73.03,19.68 SV302.30 73.03,22.23 73.03,35.56 SV303.30 73.03,38.1 73.03,49.72 74.3,50.99 SV301.30 73.66,52.7 73.03,53.34 73.03,57.78 v69.85,60.96 68.58,60.96 64.77,64.77 v17.14,64.77 | v15.88,72.39 14.61,73.66 IC201.8
!VPA
  Bottom 0.203: SV102.11 58.42,86.36 58.42,88.53 55.87,91.08 53.7,91.08 SV104.11
+5V  (via drill 0.35)
  Top 0.203: IC104.1 v81.28,75.56 | v81.28,74.3 v81.28,69.22 | IC103.1 65.41,76.2 64.77,75.56 49.53,75.56 | 49.53,75.56 35.56,75.56 | IC102.1 49.53,75.56 | R101.2 v38.73,46.35 | v14.61,55.88 15.03,55.46 R301.1 R102.2 R302.1 R303.1 R304.1 | C102.+ 10.73,87 R103.1
  Top 0.406: v49.53,69.22 IC102.20 C101.1 | v65.41,69.22 IC103.20 C103.1 | v81.28,69.22 IC104.20 C104.1 | v97.16,69.22 IC101.20 C105.1 | IC201.24 C202.1 32.47,64.36 C201.+
  Top 0.813: SV101.1 21.59,81.92 22.86,80.64 34.29,80.64 35.56,79.38 35.56,75.56 C201.+ 37.87,64.36 38.73,63.5 SV301.1 | SV303.1 SV303.2 | SV302.1 SV302.2 C306.+ | SV304.1 SV304.2 | C102.+ 11.43,87.59 11.71,87.31 C107.1 21.27,87.31 SV101.2
  Bottom 0.203: v81.28,75.56 v81.28,74.3 | v14.61,55.88 31.75,55.88 33.02,57.15 35.56,57.15 35.88,56.84 C301.1
  Bottom 0.406: 67.31,69.22 v65.41,69.22 v49.53,69.22 33.02,69.22 IC201.24 | 67.31,69.22 v81.28,69.22 v97.16,69.22 | C106.+ 67.72,68.81 67.31,69.22
  Bottom 0.813: SV103.2 SV103.1 13.97,89.53 12.13,87.69 C102.+ | SV101.2 SV101.1 | SV301.2 SV301.1 C301.1 | SV301.2 v38.73,46.35 SV303.1 C303.1 | SV303.2 SV302.1 C302.1 | SV302.2 SV304.1 C304.1 | SV301.2 36.2,52.7 35.79,52.3 C305.+
A0
  Top 0.203: SV101.17 42.82,84.18 42.82,81.13 44.45,79.51 IC102.5
  Bottom 0.203: SV103.17 35.56,91.44 37.47,91.44 40.64,88.27 40.64,86.36 SV101.17
A1
  Top 0.203: IC102.7 41.91,79.38 39.37,81.92 SV101.15
  Bottom 0.203: SV103.15 33.02,91.44 34.92,91.44 38.1,88.27 38.1,86.36 SV101.15
A2
  Top 0.203: IC102.9 39.37,79.38 36.83,81.92 SV101.13
  Bottom 0.203: SV103.13 30.48,91.44 32.38,91.44 35.56,88.27 35.56,86.36 SV101.13
A3
  Top 0.203: IC102.8 40.64,79.38 38.1,81.92 38.1,85.72 36.83,87 SV101.14 36.83,88.27 33.02,92.08 33.02,93.34 32.38,93.98 30.48,93.98 SV103.14
A4
  Top 0.203: IC102.6 43.18,79.38 40.64,81.92 40.64,85.72 39.37,87 SV101.16 39.37,88.27 35.56,92.08 35.56,93.34 34.92,93.98 33.02,93.98 SV103.16
A5
  Top 0.203: IC102.4 45.72,79.38 43.18,81.92 43.18,85.72 41.91,87 SV101.18 41.91,88.27 38.1,92.08 38.1,93.34 37.47,93.98 35.56,93.98 SV103.18
A6
  Top 0.203: IC102.3 46.99,79.38 45.72,80.64 45.72,85.72 44.45,87 SV101.20 44.45,88.27 40.64,92.08 40.64,93.34 40.01,93.98 38.1,93.98 SV103.20
A7
  Top 0.203: IC102.2 48.26,85.72 46.99,87 SV102.2 46.99,88.27 43.18,92.08 43.18,93.34 42.55,93.98 40.64,93.98 SV104.2
A8
  Top 0.203: IC103.9 55.24,79.38 50.8,83.82 50.8,85.72 49.53,87 SV102.4 49.53,88.27 45.72,92.08 45.72,93.34 45.09,93.98 43.18,93.98 SV104.4
A9
  Top 0.203: IC103.8 56.52,79.38 53.34,82.55 53.34,85.72 52.07,87 SV102.6 52.07,88.27 48.26,92.08 48.26,93.34 47.62,93.98 45.72,93.98 SV104.6
A10
  Top 0.203: IC103.7 57.78,79.38 55.88,81.28 55.88,85.72 54.61,87 SV102.8 54.61,88.27 50.8,92.08 50.8,93.34 50.16,93.98 48.26,93.98 SV104.8
A11
  Top 0.203: IC103.6 59.05,79.38 58.42,80.01 58.42,85.72 57.15,87 SV102.10 57.15,88.27 53.34,92.08 53.34,93.34 52.7,93.98 50.8,93.98 SV104.10
A12
  Top 0.203: IC103.5 60.33,79.38 60.96,80.01 60.96,85.72 59.69,87 SV102.12 59.69,88.27 55.88,92.08 55.88,93.34 55.24,93.98 53.34,93.98 SV104.12
A13
  Top 0.203: IC103.4 61.59,79.38 63.5,81.28 63.5,85.72 62.23,87 SV102.14 62.23,88.27 58.42,92.08 58.42,93.34 57.78,93.98 55.88,93.98 SV104.14
A14
  Top 0.203: IC103.3 62.87,79.24 64.62,81 65.76,81 66.04,81.28 66.04,85.72 64.77,87 SV102.16 64.77,90.81 63.5,92.08 63.5,93.34 62.87,93.98 58.42,93.98 SV104.16
A15
  Top 0.203: IC103.2 64.14,79.38 65.41,80.64 67.94,80.64 68.58,81.28 68.58,85.72 69.85,87 SV102.20 68.58,88.9 68.58,93.34 67.94,93.98 63.5,93.98 SV104.20
A16
  Top 0.203: IC104.8 72.39,79.38 74.93,81.92 75.56,81.92 76.2,82.55 76.2,85.72 74.93,87 SV102.24 74.93,88.27 71.12,92.08 71.12,93.34 70.48,93.98 69.22,93.98 67.94,95.25 SV104.24
A17
  Top 0.203: IC104.7 73.66,79.38 75.72,81.43 78.26,81.43 78.74,81.92 78.74,85.72 77.47,87 SV102.26 73.66,91.44 73.66,93.34 73.03,93.98 71.75,93.98 70.48,95.25 SV104.26
A18
  Top 0.203: IC104.6 74.93,79.38 76.63,81.08 80.44,81.08 81.28,81.92 81.28,85.72 80.01,87 SV102.28 80.01,88.27 76.2,92.08 76.2,93.34 75.56,93.98 74.3,93.98 73.03,95.25 SV104.28
A19
  Top 0.203: IC104.4 77.47,79.38 78.46,80.37 83.54,80.37 83.82,80.64 83.82,85.72 82.55,87 SV102.30 82.55,88.27 78.74,92.08 78.74,93.34 78.11,93.98 76.83,93.98 75.56,95.25 SV104.30
BUF_DATA_DIR  (via drill 0.35)
  Top 0.203: IC101.1 97.16,75.56 96.52,74.93 v38.1,74.93 | IC201.15 9.53,71.12 12.7,74.3 33.66,74.3 v34.29,74.93
  Bottom 0.203: v38.1,74.93 v34.29,74.93
CLK
  Bottom 0.203: IC201.1 32.38,79.38 33.66,80.64 71.12,80.64 72.39,81.92 SV102.21 71.12,86.36 71.12,88.27 68.3,91.08 66.4,91.08 SV104.21
D0
  Top 0.203: IC101.7 89.53,79.38 90.17,80.01 SV102.35
  Bottom 0.203: SV104.35 83.82,91.44 85.86,91.44 88.9,88.4 88.9,86.36 SV102.35
D1
  Top 0.203: IC101.5 92.08,79.38 92.71,80.01 SV102.37
  Bottom 0.203: SV104.37 86.36,91.44 88.27,91.44 91.44,88.27 91.44,86.36 SV102.37
D2
  Top 0.203: IC101.3 94.61,79.38 95.25,80.01 SV102.39
  Bottom 0.203: SV104.39 89.53,92.71 93.98,88.27 93.98,86.36 SV102.39
D3
  Top 0.203: IC101.2 95.89,83.82 96.52,84.45 96.52,85.72 95.25,87 SV102.40 SV104.40
D4
  Top 0.203: IC101.4 93.34,79.38 93.98,80.01 93.98,85.72 92.71,87 SV102.38 92.71,89.53 88.27,93.98 87,93.98 85.72,95.25 SV104.38
D5
  Top 0.203: IC101.6 90.81,79.38 91.44,80.01 91.44,85.72 90.17,87 SV102.36 90.17,88.27 86.36,92.08 86.36,93.34 85.72,93.98 83.82,93.98 SV104.36
D6
  Top 0.203: IC101.8 88.27,79.38 88.9,80.01 88.9,85.72 87.63,87 SV102.34 87.63,88.27 83.82,92.08 83.82,93.34 83.19,93.98 81.28,93.98 SV104.34
D7
  Top 0.203: IC101.9 87,79.38 86.36,80.01 86.36,85.72 85.09,87 SV102.32 85.09,88.27 81.28,92.08 81.28,93.34 80.64,93.98 79.38,93.98 78.11,95.25 SV104.32
E
  Bottom 0.203: SV104.13 55.88,91.44 57.92,91.44 60.96,88.4 60.96,86.36 SV102.13
FC0
  Bottom 0.203: SV103.19 38.1,91.44 40.14,91.44 43.18,88.4 43.18,86.36 SV101.19
FC1
  Bottom 0.203: SV104.1 42.9,89.18 44.81,89.18 45.72,88.27 45.72,86.36 SV102.1
FC2
  Bottom 0.203: SV104.3 45.72,88.9 47.62,88.9 48.26,88.27 48.26,86.36 SV102.3
GND  (via drill 0.35)
  other vias: 80.01,82.55 77.47,82.55 82.55,81.28 67.31,82.55 64.77,82.55 62.23,82.55 59.69,82.55 57.15,82.55 54.61,82.55 49.53,82.55 44.45,82.55 85.09,82.55 0.64,0.64 0.64,3.81 0.64,6.99 0.64,10.16 0.64,13.34 0.64,16.51 0.64,19.68 0.64,22.86 0.64,26.04 0.64,29.21 0.64,32.38 0.64,35.56 0.64,38.73 0.64,41.91 0.64,45.09 0.64,48.26 0.64,51.44 0.64,54.61 0.64,57.78 0.64,60.96 0.64,64.14 0.64,67.31 0.64,70.48 0.64,73.66 0.64,76.83 0.64,80.01 0.64,83.19 0.64,86.36 0.64,89.53 0.64,92.71 0.64,95.89 0.64,99.06 89.53,99.06 86.36,99.06 83.19,99.06 80.01,99.06 76.83,99.06 73.66,99.06 70.48,99.06 67.31,99.06 64.14,99.06 60.96,99.06 57.78,99.06 54.61,99.06 51.44,99.06 48.26,99.06 45.09,99.06 41.91,99.06 38.73,99.06 35.56,99.06 32.38,99.06 29.21,99.06 26.04,99.06 22.86,99.06 19.68,99.06 16.51,99.06 13.34,99.06 10.16,99.06 6.99,99.06 3.81,99.06 92.71,99.06 95.89,99.06 99.06,99.06 99.06,10.16 99.06,13.34 99.06,16.51 99.06,19.68 99.06,22.86 99.06,26.04 99.06,29.21 99.06,32.38 99.06,35.56 99.06,38.73 99.06,41.91 99.06,45.09 99.06,48.26 99.06,51.44 99.06,54.61 99.06,57.78 99.06,60.96 99.06,64.14 99.06,67.31 99.06,70.48 99.06,73.66 99.06,76.83 99.06,80.01 99.06,83.19 99.06,86.36 99.06,89.53 99.06,92.71 99.06,95.89 99.06,6.99 99.06,3.81 99.06,0.64 51.44,0.64 48.26,0.64 45.09,0.64 41.91,0.64 38.73,0.64 35.56,0.64 32.38,0.64 29.21,0.64 26.04,0.64 22.86,0.64 19.68,0.64 16.51,0.64 13.34,0.64 10.16,0.64 6.99,0.64 3.81,0.64 95.89,0.64 92.71,0.64 89.53,0.64 86.36,0.64 83.19,0.64 80.01,0.64 76.83,0.64 73.66,0.64 70.48,0.64 67.31,0.64 64.14,0.64 60.96,0.64 57.78,0.64 54.61,0.64 41.91,82.55 46.99,82.55 48.9,90.17 46.35,90.17 51.44,90.17 54.61,89.53 62.87,90.17 66.67,90.17 70.48,90.17 70.48,82.55 74.3,82.55 41.27,14.29 41.27,18.41 41.27,10.16 41.27,26.04 41.27,34.29 41.27,30.16 41.27,50.16 41.27,41.91 70.17,41.91 70.17,34.29 70.17,50.16 70.17,26.04 70.17,30.16 70.17,18.41 70.17,10.16 70.17,14.29 70.17,46.04 66.04,34.29 66.04,30.16 66.04,26.04 74.3,26.04 74.3,30.16 74.3,34.29 74.3,41.91 74.3,46.04 74.3,50.16 66.04,50.16 66.04,41.91 66.04,46.04 66.04,18.41 66.04,14.29 66.04,10.16 74.3,18.41 74.3,14.29 74.3,10.16 49.53,60.96 81.28,60.96 65.41,60.96 35.56,59.69 32.38,60.96
  pour Top: 0,0 0,99.69 99.69,99.69 99.69,0
  pour Bottom: 0,0 0,99.69 99.69,99.69 99.69,0
N$1
  Top 0.203: R302.2 LED302.A
N$2
  Top 0.203: R301.2 LED301.A
N$3
  Top 0.203: R304.2 LED304.A
N$4
  Top 0.203: R103.2 3.6,84.4 LED101.A
N$5
  Top 0.203: R303.2 LED303.A
R/!W!
  Top 0.203: IC104.5 76.2,79.24 77.68,80.72 80.72,80.72 82.55,82.55 SV102.29
  Bottom 0.203: SV104.29 76.2,91.44 78.24,91.44 81.28,88.4 81.28,86.36 SV102.29
SLOT_A0
  Top 0.203: SV301.12 50.8,52.7 50.16,53.34 50.16,56.28 43.18,63.26 IC102.15
  Bottom 0.203: SV301.12 51.44,51.21 50.47,50.24 50.47,38.34 51.44,37.37 SV303.12 51.44,35.33 50.47,34.37 50.47,22.46 51.44,21.5 SV302.12 51.44,19.46 50.47,18.49 50.47,6.58 51.44,5.62 SV304.12
SLOT_A1
  Top 0.203: IC102.13 40.64,64.77 47.62,57.78 47.62,53.34 48.26,52.7 SV301.10
  Bottom 0.203: SV301.10 48.9,51.21 47.93,50.24 47.93,38.34 48.9,37.37 SV303.10 48.9,35.33 47.93,34.37 47.93,22.46 48.9,21.5 SV302.10 48.9,19.46 47.93,18.49 47.93,6.58 48.9,5.62 SV304.10
SLOT_A2
  Top 0.203: IC102.11 38.1,66.3 45.09,59.32 45.09,53.34 45.72,52.7 SV301.8
  Bottom 0.203: SV301.8 46.35,51.21 45.39,50.24 45.39,38.34 46.35,37.37 SV303.8 46.35,35.33 45.39,34.37 45.39,22.46 46.35,21.5 SV302.8 46.35,19.46 45.39,18.49 45.39,6.58 46.35,5.62 SV304.8
SLOT_A3
  Top 0.203: SV301.7 46.35,58.55 39.37,65.54 IC102.12
  Bottom 0.203: SV301.7 46.35,54.7 47.32,53.74 47.32,51.03 46.35,50.07 SV303.7 46.35,38.51 47.32,37.54 47.32,35.16 46.35,34.2 SV302.7 46.35,22.63 47.32,21.67 47.32,19.29 46.35,18.32 SV304.7
SLOT_A4
  Top 0.203: SV301.9 48.9,57.04 41.91,64.03 IC102.14
  Bottom 0.203: SV301.9 48.9,54.7 49.86,53.74 49.86,51.03 48.9,50.07 SV303.9 48.9,38.51 49.86,37.54 49.86,35.16 48.9,34.2 SV302.9 48.9,22.63 49.86,21.67 49.86,19.29 48.9,18.32 SV304.9
SLOT_A5
  Top 0.203: IC102.16 44.45,62.49 51.44,55.51 SV301.11
  Bottom 0.203: SV301.11 51.44,54.7 52.4,53.74 52.4,51.03 51.44,50.07 SV303.11 51.44,38.51 52.4,37.54 52.4,35.16 51.44,34.2 SV302.11 51.44,22.63 52.4,21.67 52.4,19.29 51.44,18.32 SV304.11
SLOT_A6
  Top 0.203: SV301.14 53.34,52.7 52.7,53.34 52.7,56.01 52.2,56.52 50.93,56.52 45.72,61.73 IC102.17
  Bottom 0.203: SV301.14 53.98,51.21 53.01,50.24 53.01,38.34 53.98,37.37 SV303.14 53.98,35.33 53.01,34.37 53.01,22.46 53.98,21.5 SV302.14 53.98,19.46 53.01,18.49 53.01,6.58 53.98,5.62 SV304.14
SLOT_A7
  Top 0.203: SV301.13 52.35,56.87 51.08,56.87 46.99,60.96 IC102.18
  Bottom 0.203: SV301.13 53.98,54.7 54.94,53.74 54.94,51.03 53.98,50.07 SV303.13 53.98,38.51 54.94,37.54 54.94,35.16 53.98,34.2 SV302.13 53.98,22.63 54.94,21.67 54.94,19.29 53.98,18.32 SV304.13
SLOT_A8
  Top 0.203: IC103.11 53.98,59.05 55.24,57.78 55.24,53.34 55.88,52.7 SV301.16
  Bottom 0.203: SV301.16 56.52,51.21 55.55,50.24 55.55,38.34 56.52,37.37 SV303.16 56.52,35.33 55.55,34.37 55.55,22.46 56.52,21.5 SV302.16 56.52,19.46 55.55,18.49 55.55,6.58 56.52,5.62 SV304.16
SLOT_A9
  Top 0.203: IC103.12 55.24,59.05 56.52,57.78 SV301.15
  Bottom 0.203: SV301.15 56.52,54.7 57.48,53.74 57.48,51.03 56.52,50.07 SV303.15 56.52,38.51 57.48,37.54 57.48,35.16 56.52,34.2 SV302.15 56.52,22.63 57.48,21.67 57.48,19.29 56.52,18.32 SV304.15
SLOT_A10
  Top 0.203: IC103.13 56.52,59.05 57.78,57.78 57.78,53.34 58.42,52.7 SV301.18
  Bottom 0.203: SV301.18 59.05,51.21 58.09,50.24 58.09,38.34 59.05,37.37 SV303.18 59.05,35.33 58.09,34.37 58.09,22.46 59.05,21.5 SV302.18 59.05,19.46 58.09,18.49 58.09,6.58 59.05,5.62 SV304.18
SLOT_A11
  Top 0.203: IC103.14 57.78,59.05 59.05,57.78 SV301.17
  Bottom 0.203: SV301.17 59.05,54.7 60.02,53.74 60.02,51.03 59.05,50.07 SV303.17 59.05,38.51 60.02,37.54 60.02,35.16 59.05,34.2 SV302.17 59.05,22.63 60.02,21.67 60.02,19.29 59.05,18.32 SV304.17
SLOT_A12
  Top 0.203: IC103.15 59.05,59.05 60.33,57.78 60.33,53.34 60.96,52.7 SV301.20
  Bottom 0.203: SV301.20 61.59,51.21 60.63,50.24 60.63,38.34 61.59,37.37 SV303.20 61.59,35.33 60.63,34.37 60.63,22.46 61.59,21.5 SV302.20 61.59,19.46 60.63,18.49 60.63,6.58 61.59,5.62 SV304.20
SLOT_A13
  Top 0.203: IC103.16 60.33,59.05 61.59,57.78 SV301.19
  Bottom 0.203: SV301.19 61.59,54.7 62.56,53.74 62.56,51.03 61.59,50.07 SV303.19 61.59,38.51 62.56,37.54 62.56,35.16 61.59,34.2 SV302.19 61.59,22.63 62.56,21.67 62.56,19.29 61.59,18.32 SV304.19
SLOT_A14
  Top 0.203: IC103.17 61.59,59.05 62.87,57.78 62.87,53.34 63.5,52.7 SV301.22
  Bottom 0.203: SV301.22 64.14,51.21 63.17,50.24 63.17,38.34 64.14,37.37 SV303.22 64.14,35.33 63.17,34.37 63.17,22.46 64.14,21.5 SV302.22 64.14,19.46 63.17,18.49 63.17,6.58 64.14,5.62 SV304.22
SLOT_A15
  Top 0.203: IC103.18 62.87,59.05 64.14,57.78 SV301.21
  Bottom 0.203: SV301.21 64.14,54.7 65.1,53.74 65.1,51.03 64.14,50.07 SV303.21 64.14,38.51 65.1,37.54 65.1,35.16 64.14,34.2 SV302.21 64.14,22.63 65.1,21.67 65.1,19.29 64.14,18.32 SV304.21
SLOT_A16  (via drill 0.35)
  Top 0.203: v71.12,74.3 IC104.12
  Bottom 0.203: IC201.3 27.3,74.93 27.94,74.3 v71.12,74.3
SLOT_A17  (via drill 0.35)
  Top 0.203: IC104.13 v72.39,73.66
  Bottom 0.203: IC201.4 24.77,74.93 26.04,73.66 v72.39,73.66
SLOT_A18  (via drill 0.35)
  Top 0.203: IC104.14 v73.66,73.03
  Bottom 0.203: IC201.5 22.23,74.3 23.5,73.03 v73.66,73.03
SLOT_A19  (via drill 0.35)
  Top 0.203: IC104.16 v76.2,71.75
  Bottom 0.203: IC201.7 17.14,73.03 18.41,71.75 v76.2,71.75
SLOT_D0
  Top 0.203: IC101.13 88.27,62.87 81.92,56.52 SV301.35
  Bottom 0.203: SV301.35 81.92,54.7 82.88,53.74 82.88,51.03 81.92,50.07 SV303.35 81.92,38.51 82.88,37.54 82.88,35.16 81.92,34.2 SV302.35 81.92,22.63 82.88,21.67 82.88,19.29 81.92,18.32 SV304.35
SLOT_D1
  Top 0.203: IC101.15 90.81,64.14 84.45,57.78 SV301.37
  Bottom 0.203: SV301.37 84.45,54.7 85.42,53.74 85.42,51.03 84.45,50.07 SV303.37 84.45,38.51 85.42,37.54 85.42,35.16 84.45,34.2 SV302.37 84.45,22.63 85.42,21.67 85.42,19.29 84.45,18.32 SV304.37
SLOT_D2
  Top 0.203: IC101.17 93.34,65.41 87,59.05 SV301.39
  Bottom 0.203: SV301.39 87,54.7 87.96,53.74 87.96,51.03 87,50.07 SV303.39 87,38.51 87.96,37.54 87.96,35.16 87,34.2 SV302.39 87,22.63 87.96,21.67 87.96,19.29 87,18.32 SV304.39
SLOT_D3
  Top 0.203: SV301.40 87,53.34 88.27,54.61 88.27,59.69 94.61,66.04 IC101.18
  Bottom 0.203: SV301.40 87,51.21 86.03,50.24 86.03,38.34 87,37.37 SV303.40 87,35.33 86.03,34.37 86.03,22.46 87,21.5 SV302.40 87,19.46 86.03,18.49 86.03,6.58 87,5.62 SV304.40
SLOT_D4
  Top 0.203: IC101.16 92.08,64.77 85.72,58.42 85.72,53.34 85.09,52.7 SV301.38
  Bottom 0.203: SV301.38 84.45,51.21 83.49,50.24 83.49,38.34 84.45,37.37 SV303.38 84.45,35.33 83.49,34.37 83.49,22.46 84.45,21.5 SV302.38 84.45,19.46 83.49,18.49 83.49,6.58 84.45,5.62 SV304.38
SLOT_D5
  Top 0.203: IC101.14 89.53,63.5 83.19,57.15 83.19,53.34 82.55,52.7 SV301.36
  Bottom 0.203: SV301.36 81.92,51.21 80.95,50.24 80.95,38.34 81.92,37.37 SV303.36 81.92,35.33 80.95,34.37 80.95,22.46 81.92,21.5 SV302.36 81.92,19.46 80.95,18.49 80.95,6.58 81.92,5.62 SV304.36
SLOT_D6
  Top 0.203: IC101.12 87,62.23 80.64,55.88 80.64,53.34 80.01,52.7 SV301.34
  Bottom 0.203: SV301.34 79.38,51.21 78.41,50.24 78.41,38.34 79.38,37.37 SV303.34 79.38,35.33 78.41,34.37 78.41,22.46 79.38,21.5 SV302.34 79.38,19.46 78.41,18.49 78.41,6.58 79.38,5.62 SV304.34
SLOT_D7
  Top 0.203: IC101.11 85.72,61.59 SV301.33
  Bottom 0.203: SV301.33 79.38,54.7 80.34,53.74 80.34,51.03 79.38,50.07 SV303.33 79.38,38.51 80.34,37.54 80.34,35.16 79.38,34.2 SV302.33 79.38,22.63 80.34,21.67 80.34,19.29 79.38,18.32 SV304.33
SLOT_R/!W!  (via drill 0.35)
  Top 0.203: v74.93,72.39 IC104.15 74.93,64.77 66.67,56.52 SV301.23
  Bottom 0.203: IC201.6 19.68,73.66 20.95,72.39 v74.93,72.39 | SV301.23 67.94,53.98 67.94,40.64 SV303.23 67.94,38.1 67.94,24.77 SV302.23 67.94,22.23 67.94,8.89 SV304.23

### Text on the board
tNames: Slot 1 | Slot 2 | 68komputer-008 Backplane | Rev 01 - By Tristan Seifert | Slot 3 | Slot 4
bNames: blraaz it